# Altium schematic sheet nguyenly.SchDoc
size A
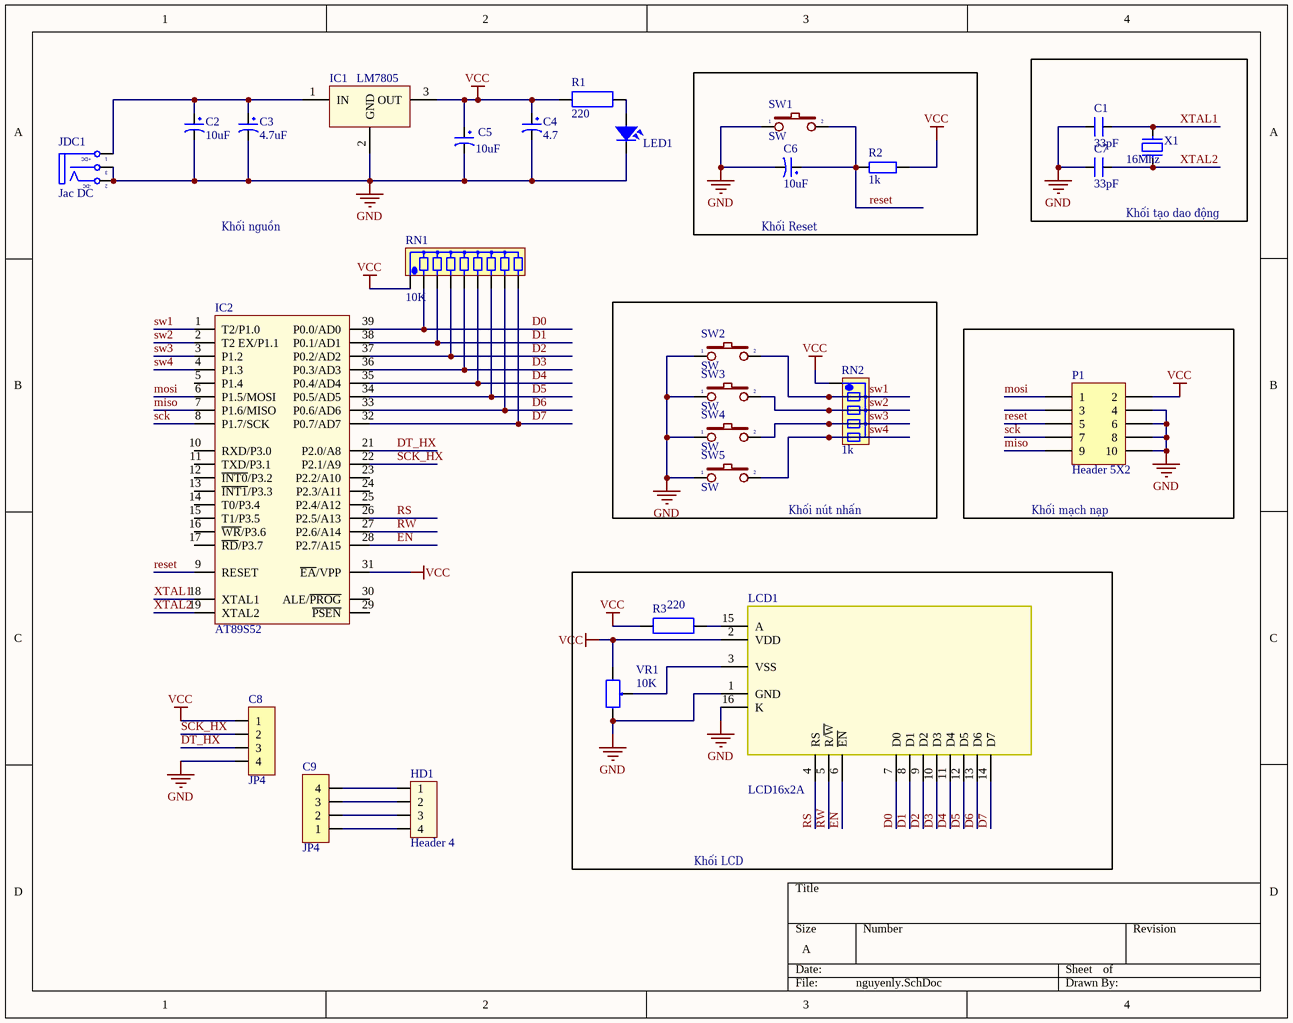
[diagram p0: nguyenly.SchDoc]

## Parts
C1  33pF  [CN1]
C2  10uF  [CP1/2]
C3  4.7uF  [CP1/2]
C4  4.7  [CP1/2]
C5  10uF  [CP1/2]
C6  10uF  [CP1/2]
C7  33pF  [CN1]
C8  JP4  [JP4-C1C]
C9  JP4  [JP4-C1C]
HD1  Header 4  [HED4]
IC1  LM7805  [QTO-220]
IC2  AT89S52  [DIP40/W0.6]
JDC1  Jac DC  [DC-IN]
LCD1  LCD16x2A  [LCD16X2]
LED1  LED  [LED-3]  (value not drawn)
P1  Header 5X2  [HDR2X5]
R1  220  [R1W]
R2  1k  [R1/4W]
R3  220  [R1W]
RN1  10K  [RN8]
RN2  1k  [RN4]
SW1  SW  [SW2]
SW2  SW  [SW2]
SW3  SW  [SW2]
SW4  SW  [SW2]
SW5  SW  [SW2]
VR1  10K  [VR]
X1  16Mhz  [XT2]

## Blocks framed on the sheet
Khối Reset: C6 R2 SW1
Khối tạo dao động: C1 C7 X1
Khối nút nhấn: RN2 SW2-SW5
Khối mạch nạp: P1
Khối LCD: LCD1 R3 VR1

## Nets
GND: C1.1 C2.2 C3.2 C4.2 C5.2 C6.2 C7.1 C8.4 IC1.2(GND) IC2.20(GND) JDC1.2(TN) JDC1.3(S) LCD1.1(GND) LCD1.16(K) LED1.2 P1.4 P1.6 P1.8 P1.10 SW1.1 SW2.1 SW3.1 SW4.1 SW5.1 VR1.3
VCC: C4.1 C5.1 C8.1 IC1.3(OUT) IC2.31(~{EA}/VPP) IC2.40(VCC) LCD1.2(VDD) P1.2 R1.1 R2.2 R3.1 RN1.1 RN2.1 VR1.1
D0: IC2.39(P0.0/AD0) LCD1.7(D0) RN1.2
D1: IC2.38(P0.1/AD1) LCD1.8(D1) RN1.3
D2: IC2.37(P0.2/AD2) LCD1.9(D2) RN1.4
D3: IC2.36(P0.3/AD3) LCD1.10(D3) RN1.5
D4: IC2.35(P0.4/AD4) LCD1.11(D4) RN1.6
D5: IC2.34(P0.5/AD5) LCD1.12(D5) RN1.7
D6: IC2.33(P0.6/AD6) LCD1.13(D6) RN1.8
D7: IC2.32(P0.7/AD7) LCD1.14(D7) RN1.9
DT_HX: C8.3 IC2.21(P2.0/A8)
EN: IC2.28(P2.7/A15) LCD1.6(~{EN})
miso: IC2.7(P1.6/MISO) P1.9
mosi: IC2.6(P1.5/MOSI) P1.1
reset: C6.1 IC2.9(RESET) P1.5 R2.1 SW1.2
RS: IC2.26(P2.5/A13) LCD1.4(RS)
RW: IC2.27(P2.6/A14) LCD1.5(R/~{W})
sck: IC2.8(P1.7/SCK) P1.7
SCK_HX: C8.2 IC2.22(P2.1/A9)
sw1: IC2.1(T2/P1.0) RN2.2 SW2.2
sw2: IC2.2(T2_EX/P1.1) RN2.3 SW3.2
sw3: IC2.3(P1.2) RN2.4 SW4.2
sw4: IC2.4(P1.3) RN2.5 SW5.2
XTAL1: C1.2 IC2.18(XTAL1) X1.1
XTAL2: C7.2 IC2.19(XTAL2) X1.2
NetC2_1: C2.1 C3.1 IC1.1(IN) JDC1.1(T)
NetC9_1: C9.1 HD1.4
NetC9_2: C9.2 HD1.3
NetC9_3: C9.3 HD1.2
NetC9_4: C9.4 HD1.1
NetLCD1_3: LCD1.3(VSS) VR1.2
NetLCD1_15: LCD1.15(A) R3.2
NetLED1_1: LED1.1 R1.2

Not connected (* = marked no-connect by the designer): IC2 5(P1.4) 10(RXD/P3.0) 11(TXD/P3.1) 12(~{INT0}/P3.2) 13(~{INT1}/P3.3) 14(T0/P3.4) 15(T1/P3.5) 16(~{WR}/P3.6) 17(~{RD}/P3.7) 23(P2.2/A10) 24(P2.3/A11) 25(P2.4/A12) 29(~{PSEN}) 30(ALE/~{PROG}); P1 3

## Notes on the sheet
- Khối nguồn
- (in symbol DCIN) +DC; -DC

## Library data of the parts
C1 C7 = CN1: Cap np  1pF - 472pF; Value: 100pF
C2-C6 = CP1: Cap P  0,1uF < 22uF , 16 - 50V; Value: 10uF/50V; Description 1: 10 => 220uF/6,3V/10V - 10uF => 100uF/16V; Description 2: 0,1uF => 33uF/50V - 10uF => 22uF/63V; Description 3: 0,47uF => 10uF/100V
C8 C9 = JP4: WR-PHD 2.54 mm Angled Socket Header; Manufacturer: W¨¹rth Elektronik eiSos GmbH; partNo: 613004143121; ComponentLink1 Description: Manufacturer; ComponentLink2 Description: Datasheet; NoPins: 04; Created Date: 29 March 2013; ComponentLink1URL: http://www.we-online.com; ComponentLink2URL: http://katalog.we-online.de/em/datasheet/6130xx143121.pdf; Created by: Karrer Zheng
HD1 = Hed4: Header 4 (Green); Value: Header 4
IC1 = LM78xx: On ap +, from + 5 to + 24VDC; Value: LM7805
IC2 = AT89S52: AT89S52, 8k Byte Flash Memory , 40 Pin; Value: AT89S52
JDC1 = DCIN: Jac DC input; Value: Jac DC
LCD1 = LCD16x2: LCD dipslay 16 char, 2 line; Value: LCD16x2A
LED1 = LED: LED Single colour Green and Red; Value: LED 3 ly Single Colour
P1 = Header 5X2: Header, 5-Pin, Dual row; LatestRevisionDate: 17-Jul-2002; LatestRevisionNote: Re-released for DXP Platform.; Publisher: Altium Limited
R1 R3 = R1W: Resistor 1W; Value: R1W - 100
R2 = R1/4W: Resistor 1/4W; Value: R1/4W - 1K
RN1 = RN8: Resistor 8 (Thanh); Value: Tro thanh 10K
RN2 = RN4: Resistor 4 (thanh); Value: Tro thanh 4K7
SW1-SW5 = SW2: Switch button 2 pin; Value: SW chip 2 pin
VR1 = VR: Var Resistor; Value: VR 10K
X1 = XT2: Crystal For all Crystal 2pin.; Value: 4Mhz